# EAGLE design 10 MHz Buffer v1.0 (EAGLE 7.3.0)
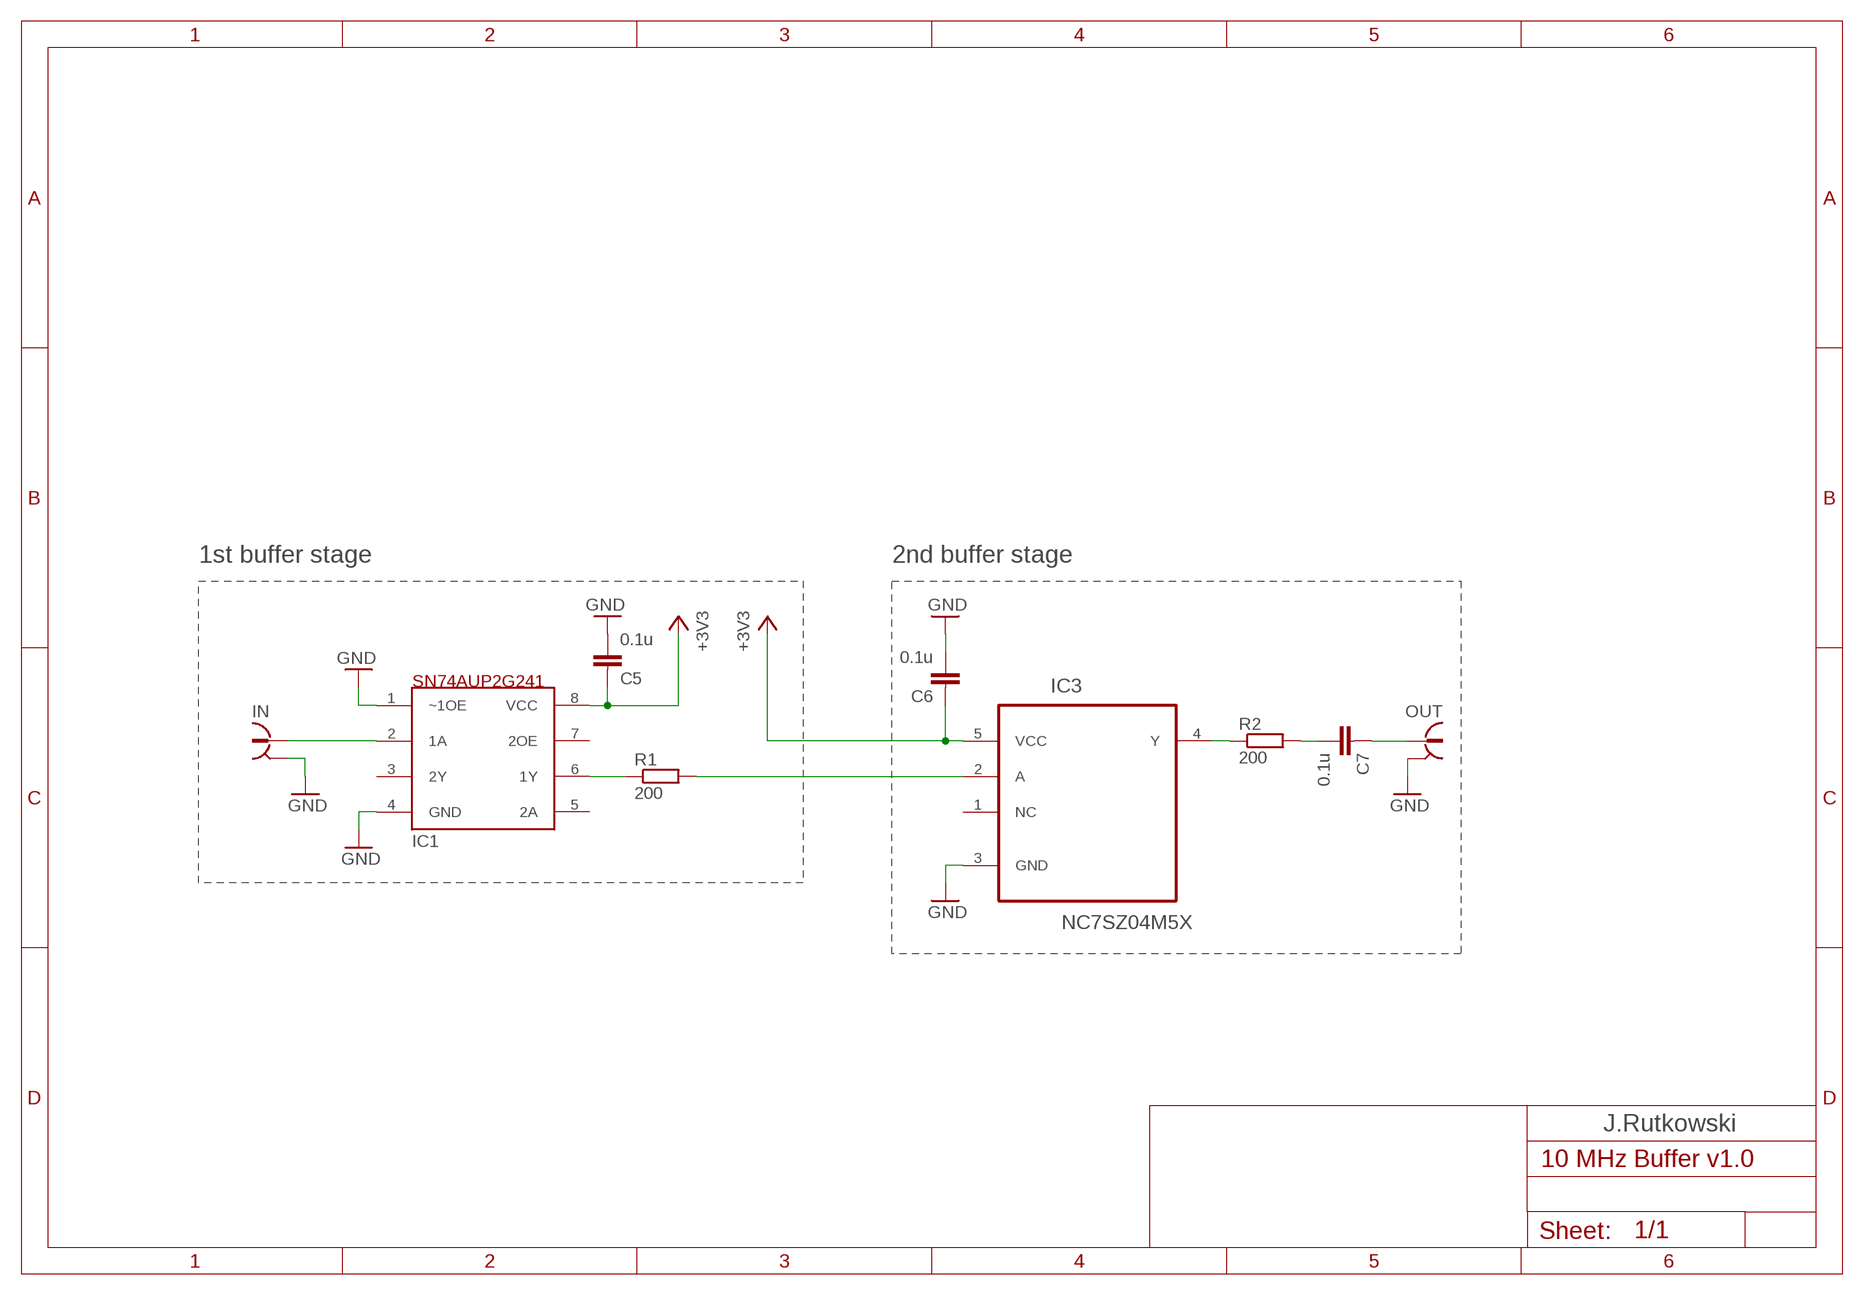
[diagram p0: schematic, sheet 1]

## Parts
C5  0.1u  C-EUC0603K  [C0603K]
C6  0.1u  C-EUC0603K  [C0603K]
C7  0.1u  C-EUC0603K  [C0603K]
IC1  SN74AUP2G241  [DCU_(R-PDSO-G8)]
IC3  NC7SZ04M5X  [SOT95P280X145-5N]
IN  734120110  [734120110]
OUT  734120110  [734120110]
R1  200  R-EU_R0603  [R0603]
R2  200  R-EU_R0603  [R0603]

## Nets
+3V3: C5.2 C6.2 IC1.8(VCC) IC3.5(VCC)
GND: C5.1 C6.1 IC1.1(~1OE) IC1.4(GND) IC3.3(GND) IN.S@1 IN.S@2 IN.S@3 OUT.S@1 OUT.S@2 OUT.S@3
N$1: IC1.2(1A) IN.1
N$2: IC1.6(1Y) R1.1
N$4: IC3.2(A) R1.2
N$5: IC3.4(Y) R2.1
N$6: C7.1 R2.2
N$7: C7.2 OUT.1
Unconnected: IC1.3(2Y) IC1.5(2A) IC1.7(2OE) IC3.1(NC)

## Notes on the sheet
- 1st buffer stage | 2nd buffer stage
- J.Rutkowski

## Library data of the parts
C5-C7 = rcl:C-EU: CAPACITOR, European symbol
IC1 = texas:SN74AUP2G241
IC3 = Custom-parts:NC7SZ04M5X: Tiny logic UHS Inverter; MPN: NC7SZ04M5X; OC_FARNELL: 1417667; OC_NEWARK: 58K1973; PACKAGE: SOT-23-5; SUPPLIER: Fairchild
IN OUT = con-coax:734120110: MICRO COAXIAL CONNECTOR RECEPTACLE VERTICAL Source: Data sheet <http://www.molex.com/pdm_docs/sd/734120110_sd.pdf>
R1 R2 = rcl:R-EU_: RESISTOR, European symbol

## Board
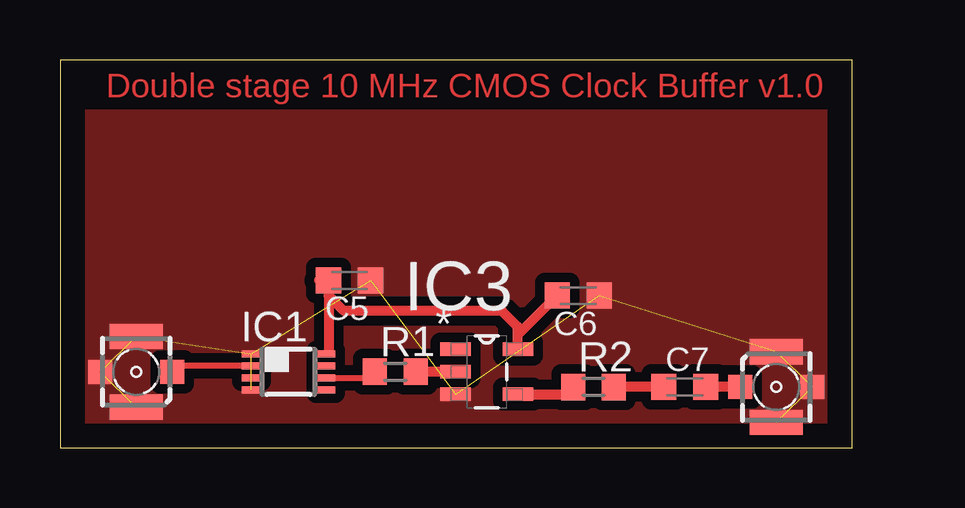
[diagram p1: board, top side]

Size 33 x 16.18 mm. Coordinates in mm from the lower left corner, seen from the top.
Outline: 0,0 33,0 33,16.18 0,16.18 0,0
Copper layers (1*16): Top 0.035mm / dielectric 1.5mm / Bottom 0.035mm
Design rules "default": minimum track width 10mil, minimum drill 24mil, track to track 8mil, track to pad 8mil, pad to pad 8mil, via to via 8mil, smd to smd 8mil, copper to edge 40mil, drill to drill 8mil, minimum pad ring 10mil, minimum via ring 8mil, stop-mask expansion 4mil, vias tented up to drill 0mil, thermal gap 10mil

### Footprints (pad centres in the part's own frame; a part is rotated, then mirrored left to right if it is on the bottom)
C0603K = smd 1.05 x 1.08: 1 -0.875,0; 2 0.875,0
DCU_(R-PDSO-G8) = smd 0.3 x 0.8: 1 -0.75,-1.55; 2 -0.25,-1.55; 3 0.25,-1.55; 4 0.75,-1.55; 5 0.75,1.55; 6 0.25,1.55; 7 -0.25,1.55; 8 -0.75,1.55
SOT95P280X145-5N = smd 1.27 x 0.559: 1 -1.295,0.94; 2 -1.295,0; 3 -1.295,-0.94; 4 1.295,-0.94; 5 1.295,0.94
734120110 = smd 1 x 1: 1 0,-1.5; S@1 0,1.5 | smd 1.05 x 2.2: S@2 -1.475,0; S@3 1.475,0
R0603 = smd 1 x 1.1: 1 -0.85,0; 2 0.85,0

### Placement (x,y rotation side)
C5  12.06,6.99 180 top
C6  21.59,6.35 180 top
C7  26.04,2.54 0 top
IC1  9.53,3.17 270 top
IC3  17.78,3.17 0 top
IN  3.17,3.17 90 top
OUT  29.84,2.54 270 top
R1  13.97,3.17 0 top
R2  22.23,2.54 0 top

### Tracks (layer width: path | path; a pad name or v marks a point on that pad's centre or on a via)
+3V3
  Top 0.254: 11.19,4.04 IC1.8 | 11.07,6.71 10.79,6.99
  Top 0.406: 10.79,6.99 C5.2 11.19,6.35 | 11.19,6.35 11.19,4.04 | C6.2 19.07,4.71 IC3.5 19.07,5.05 18.41,5.71 11.82,5.71 11.19,6.35
GND  (10 unrouted)
  pour Top (isolate 0.406, no thermals): 0,13.97 33.02,13.97 33.02,0 0,0
N$1
  Top 0.254: IC1.2 4.92,3.42 IN.1
N$2
  Top 0.254: IC1.6 12.87,2.92 R1.1
N$4
  Top 0.406: IC3.2 R1.2
N$5
  Top 0.406: IC3.4 21.07,2.23 R2.1
N$6
  Top 0.406: C7.1 R2.2
N$7
  Top 0.406: OUT.1 C7.2

### Text on the board
Top: Double stage 10 MHz CMOS Clock Buffer v1.0
Top_Legend: Supply | C1 | IC2 | C2 | C3 | C4 | C6 | IC1 | R1 | OUT | R2 | C7 | IN | FEMTO-ST 2016 | IC3